# EAGLE design PCstick (EAGLE 4.15)
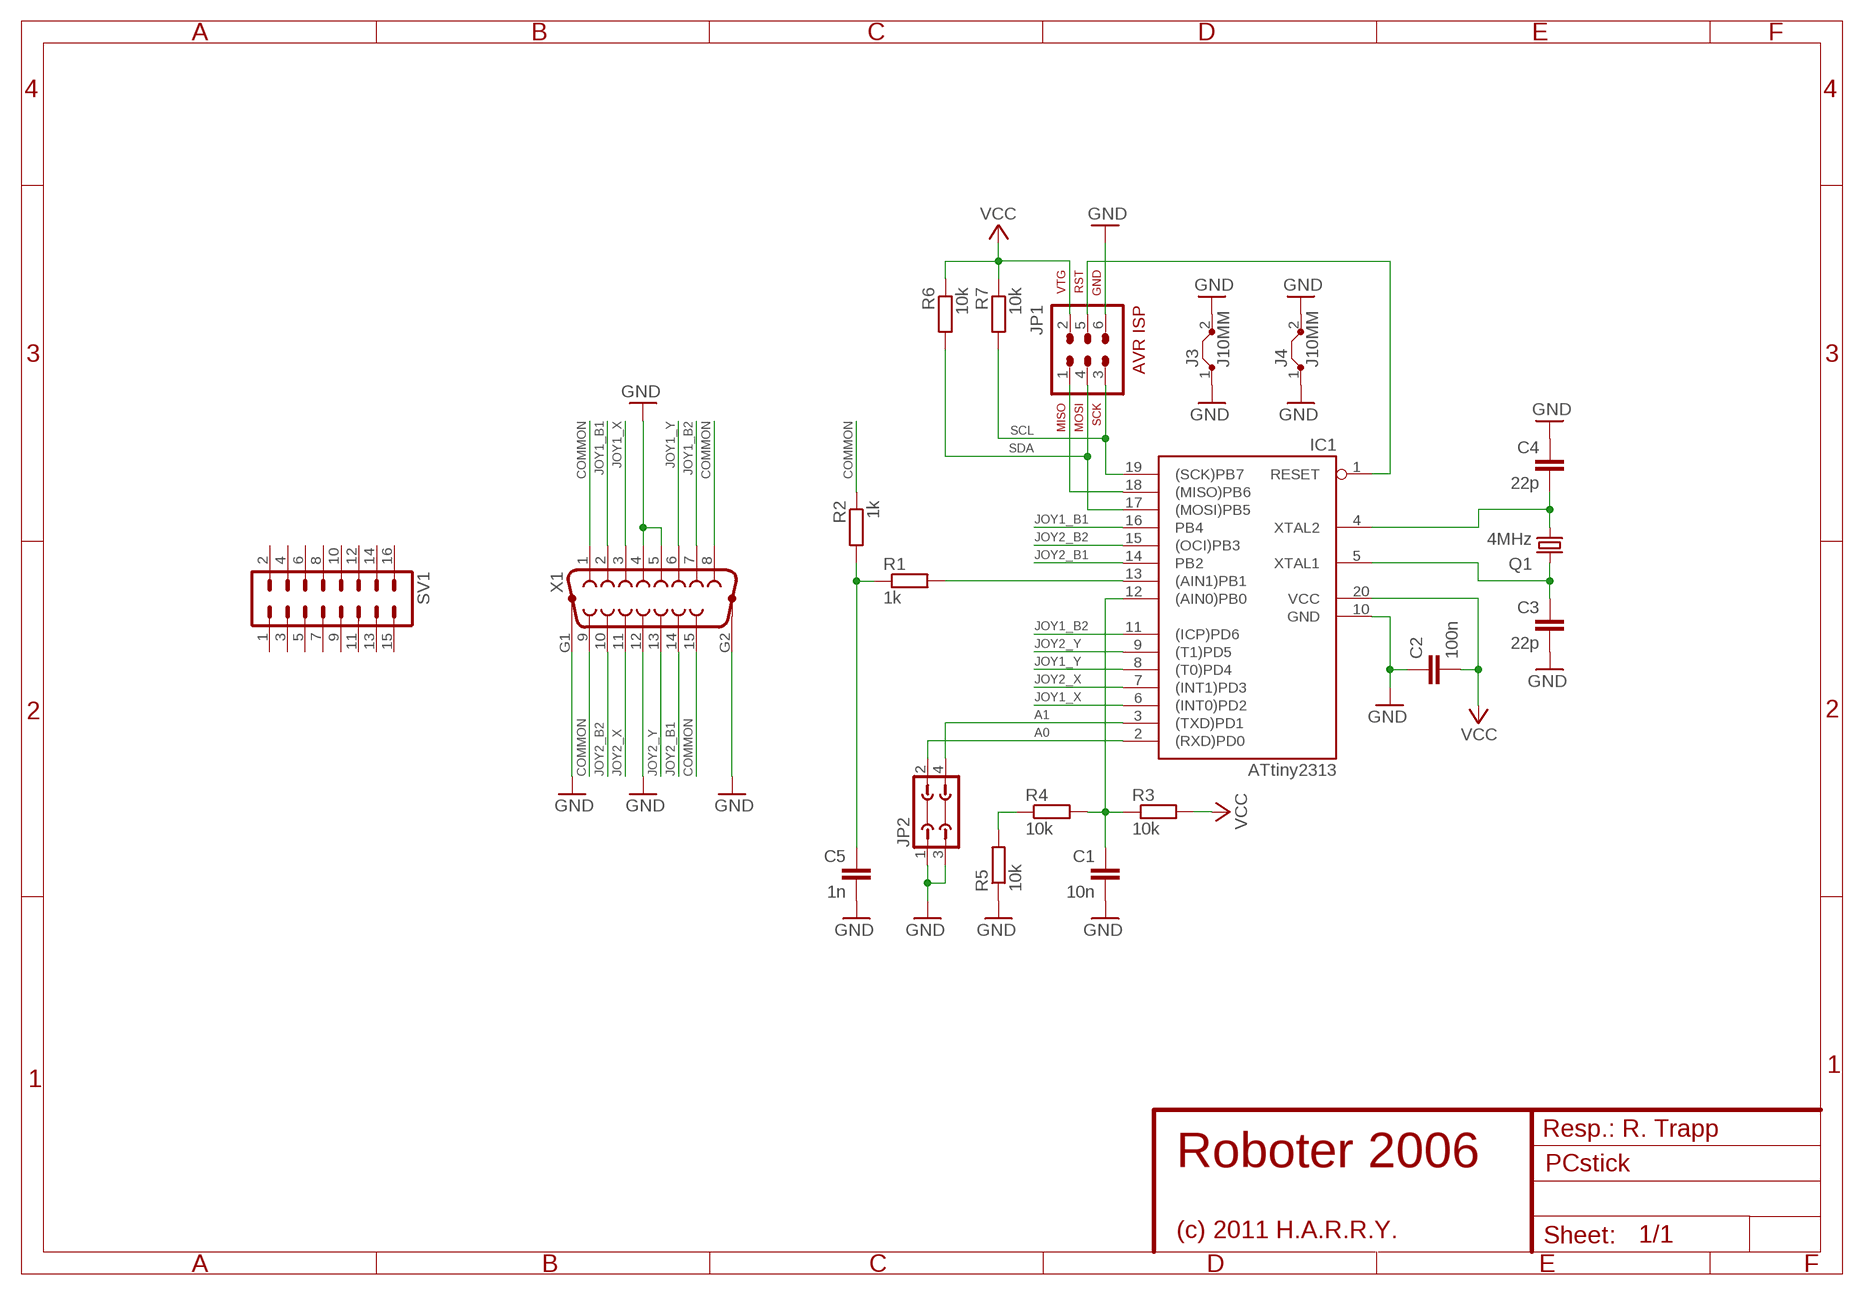
[diagram p0: schematic, sheet 1]

## Parts
C1  10n  C-EU050-025X075  [C050-025X075]
C2  100n  C-EU025-025X050  [C025-025X050]
C3  22p  C-EU025-025X050  [C025-025X050]
C4  22p  C-EU025-025X050  [C025-025X050]
C5  1n  C-EU050-025X075  [C050-025X075]
IC1  ATtiny2313  AT90S2313P  [DIL20]
J1  JUMP-Q  [JUMP]
J2  JUMP-Q  [JUMP]
J3  J10MM  [10]
J4  J10MM  [10]
JP1  AVR-ISP-6  [AVR-ISP-6]
JP2  JP2Q  [JP2Q]
Q1  4MHz  CRYTALHC49U-LM  [HC49U-LM]
R1  1k  R-EU_0204/2V  [0204V]
R2  1k  R-EU_0207/12  [0207/12]
R3  10k  R-EU_0207/15  [0207/15]
R4  10k  R-EU_0204/7  [0204/7]
R5  10k  R-EU_0204/7  [0204/7]
R6  10k  R-EU_0204/2V  [0204V]
R7  10k  R-EU_0204/2V  [0204V]
SV1  ML16  [ML16]
X1  F15VP  [F15VP]

## Nets
A0: IC1.2((RXD)PD0) JP2.2
A1: IC1.3((TXD)PD1) JP2.4
COMMON: R2.1 X1.1 X1.8 X1.9 X1.15
GND: C1.2 C2.1 C3.2 C4.1 C5.2 IC1.10(GND) J3.1 J3.2 J4.1 J4.2 JP1.6 JP2.1 JP2.3 R5.1 X1.4 X1.5 X1.12 X1.G1 X1.G2
JOY1_B1: IC1.16(PB4) X1.2
JOY1_B2: IC1.11((ICP)PD6) X1.7
JOY1_X: IC1.6((INT0)PD2) X1.3
JOY1_Y: IC1.8((T0)PD4) X1.6
JOY2_B1: IC1.14(PB2) X1.14
JOY2_B2: IC1.15((OCI)PB3) X1.10
JOY2_X: IC1.7((INT1)PD3) X1.11
JOY2_Y: IC1.9((T1)PD5) X1.13
N$1: C5.1 R1.1 R2.2
N$2: C3.1 IC1.5(XTAL1) Q1.2
N$3: C4.2 IC1.4(XTAL2) Q1.1
N$4: C1.1 IC1.12((AIN0)PB0) R3.1 R4.2
N$5: IC1.13((AIN1)PB1) R1.2
N$9: IC1.1(RESET) JP1.5
N$17: R4.1 R5.2
PB6: IC1.18((MISO)PB6) JP1.1
SCL: IC1.19((SCK)PB7) JP1.3 R7.2
SDA: IC1.17((MOSI)PB5) JP1.4 R6.2
VCC: C2.2 IC1.20(VCC) JP1.2 R3.2 R6.1 R7.1
Unconnected: SV1.1 SV1.2 SV1.3 SV1.4 SV1.5 SV1.6 SV1.7 SV1.8 SV1.9 SV1.10 SV1.11 SV1.12 SV1.13 SV1.14 SV1.15 SV1.16

## Notes on the sheet
- Resp.: R. Trapp
- Roboter 2006
- (c) 2011 H.A.R.R.Y.

## Library data of the parts
C1-C5 = rcl:C-EU: CAPACITOR, European symbol
IC1 = atmel:AT90S2313: MICROCONTROLLER 2 Kbytes FLASH 128 bytes SRAM 128 bytes EEPROM UART
J1 J2 = jumper:JUMP-Q: JUMPER header
J3 J4 = jumper:J: Bridge
JP1 = atmel-1:AVR-ISP-6: AVR ISP-6 Serial Programming Header
JP2 = jumper:JP2Q: JUMPER
Q1 = crystal:CRYTAL: CRYSTAL
R1-R7 = rcl:R-EU_: RESISTOR, European symbol
SV1 = con-harting-ml:ML16: HARTING
X1 = con-subd:F15VP: SUB-D

## Board
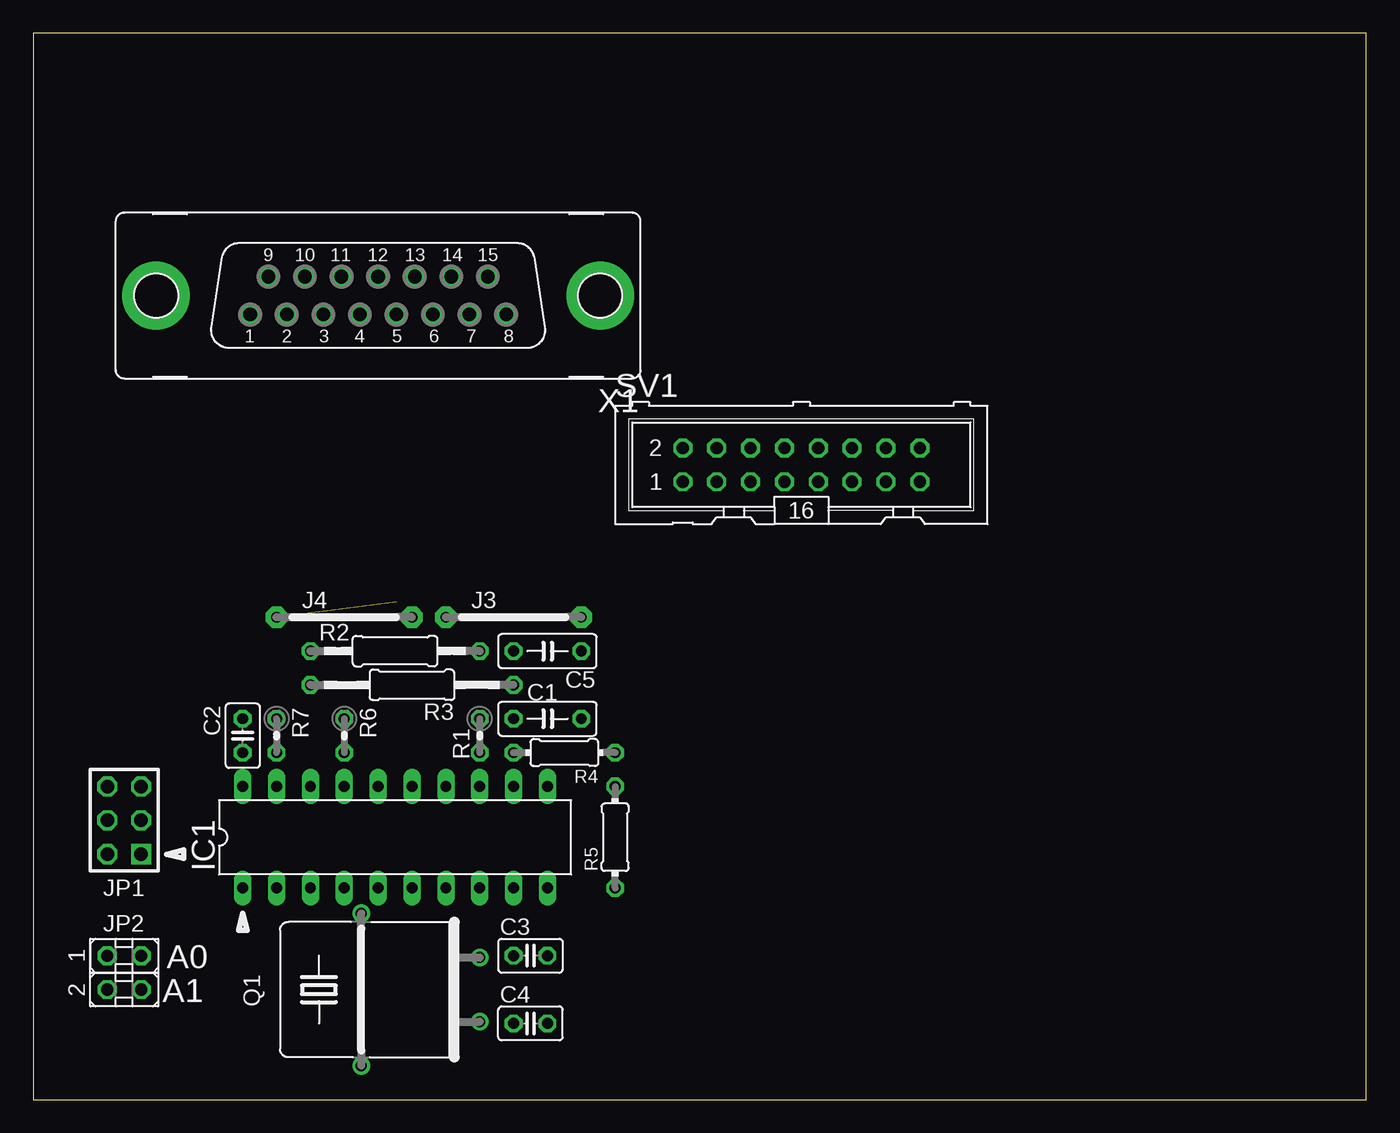
[diagram p1: board, top side]
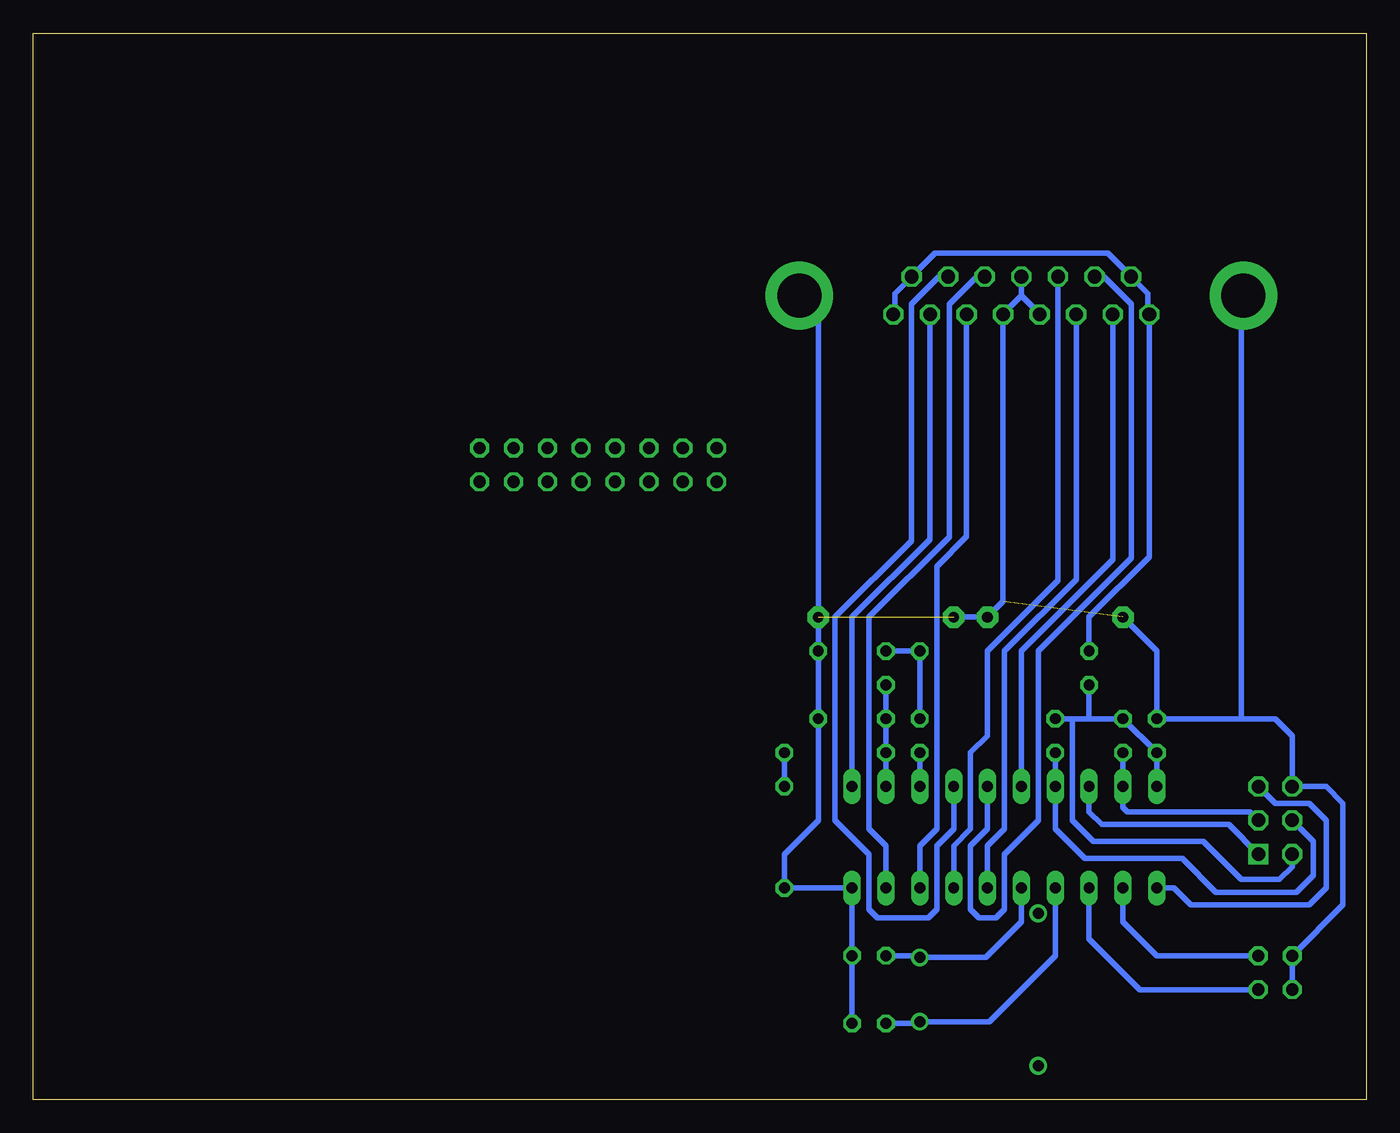
[diagram p2: board, bottom side, seen from below]

Size 100 x 80 mm. Coordinates in mm from the lower left corner, seen from the top.
Outline: 0,0 100,0 100,80 0,80 0,0
Copper layers (1*16): Top 0.035mm / dielectric 1.5mm / Bottom 0.035mm
Design rules "default": minimum track width 10mil, minimum drill 24mil, track to track 8mil, track to pad 8mil, pad to pad 8mil, via to via 8mil, smd to smd 8mil, copper to edge 40mil, drill to drill 8mil, minimum pad ring 10mil, minimum via ring 8mil, stop-mask expansion 4mil, vias tented up to drill 0mil, thermal gap 10mil

### Footprints (pad centres in the part's own frame; a part is rotated, then mirrored left to right if it is on the bottom)
C050-025X075 = drill 0.813 octagon: 1 -2.54,0; 2 2.54,0
C025-025X050 = drill 0.813 octagon: 1 -1.27,0; 2 1.27,0
DIL20 = drill 0.813 long: 1 -11.43,-3.81; 2 -8.89,-3.81; 3 -6.35,-3.81; 4 -3.81,-3.81; 5 -1.27,-3.81; 6 1.27,-3.81; 7 3.81,-3.81; 8 6.35,-3.81; 9 8.89,-3.81; 10 11.43,-3.81; 11 11.43,3.81; 12 8.89,3.81; 13 6.35,3.81; 14 3.81,3.81; 15 1.27,3.81; 16 -1.27,3.81; 17 -3.81,3.81; 18 -6.35,3.81; 19 -8.89,3.81; 20 -11.43,3.81
10 = drill 0.813 pad 1.6 octagon: 1 -5.08,0; 2 5.08,0
AVR-ISP-6 = drill 1.016 square: 1 -2.54,-1.27 | drill 1.016 octagon: 2 -2.54,1.27; 3 0,-1.27; 4 0,1.27; 5 2.54,-1.27; 6 2.54,1.27
JP2Q = drill 0.914 octagon: 1 -1.27,-1.27; 2 -1.27,1.27; 3 1.27,-1.27; 4 1.27,1.27
HC49U-LM = drill 0.813 round: 1 -2.413,-5.08; 2 2.413,-5.08; M -5.715,3.81; M1 5.715,3.81
0204V = drill 0.813 octagon: 1 -1.27,0; 2 1.27,0
0207/12 = drill 0.813 octagon: 1 -6.35,0; 2 6.35,0
0207/15 = drill 0.813 octagon: 1 -7.62,0; 2 7.62,0
0204/7 = drill 0.813 octagon: 1 -3.81,0; 2 3.81,0
ML16 = drill 0.914 octagon: 1 -8.89,-1.27; 2 -8.89,1.27; 3 -6.35,-1.27; 4 -6.35,1.27; 5 -3.81,-1.27; 6 -3.81,1.27; 7 -1.27,-1.27; 8 -1.27,1.27; 9 1.27,-1.27; 10 1.27,1.27; 11 3.81,-1.27; 12 3.81,1.27; 13 6.35,-1.27; 14 6.35,1.27; 15 8.89,-1.27; 16 8.89,1.27
F15VP = drill 1.016 octagon: 1 9.601,1.422; 2 6.858,1.422; 3 4.115,1.422; 4 1.372,1.422; 5 -1.372,1.422; 6 -4.115,1.422; 7 -6.858,1.422; 8 -9.601,1.422; 9 8.23,-1.422; 10 5.486,-1.422; 11 2.743,-1.422; 12 0,-1.422; 13 -2.743,-1.422; 14 -5.486,-1.422; 15 -8.23,-1.422 | drill 3.302 pad 5.08 round: G1 -16.662,0; G2 16.662,0

### Placement (x,y rotation side)
C1  38.57,28.57 0 top
C2  15.71,27.3 270 top
C3  37.3,10.79 0 top
C4  37.3,5.71 180 top
C5  38.57,33.65 0 top
IC1  27.14,19.68 0 top
J1  6.82,10.79 90 top
J2  6.82,8.25 90 top
J3  36.03,36.19 0 top
J4  23.33,36.19 0 top
JP1  6.82,20.95 90 top
JP2  6.82,9.52 270 top
Q1  28.41,8.25 90 top
R1  33.49,27.3 270 top
R2  27.14,33.65 0 top
R3  28.41,31.11 180 top
R4  39.84,26.03 180 top
R5  43.65,19.68 90 top
R6  23.33,27.3 270 top
R7  18.25,27.3 270 top
SV1  57.62,47.62 0 top
X1  25.87,60.32 180 top

### Tracks (layer width: path | path; a pad name or v marks a point on that pad's centre or on a via)
A0
  Bottom 0.406: IC1.2 18.25,13.33 15.71,10.79 JP2.2
A1
  Bottom 0.406: JP2.4 16.98,8.25 20.79,12.06 IC1.3
COMMON
  Bottom 0.406: R2.1 20.79,36.19 16.27,40.71 X1.1 16.27,58.97 16.37,59.08 16.37,60.47 18.12,62.23 | 33.62,62.23 32.35,63.5 19.39,63.5 18.12,62.23 | 33.62,62.23 X1.15 | 18.12,62.23 X1.9 | 33.62,62.23 35.37,60.47 35.37,59.08 35.47,58.97 X1.8
GND  (2 unrouted)
  Bottom 0.406: C4.1 C3.2 IC1.10 R5.1 43.65,18.41 41.11,20.95 C1.2 C5.2 J3.2 41.11,58.9 X1.G1 | 25.87,60.32 X1.12 | 25.87,60.32 27.24,58.95 X1.5 27.24,37.36 J4.2 J3.1 | X1.4 24.5,58.95 25.87,60.32 | 9.36,28.57 6.82,28.57 5.55,27.3 JP1.6 3.01,23.49 1.74,22.22 1.74,14.6 JP2.1 JP2.3 | 9.36,28.57 C2.1 15.71,33.65 J4.1 | X1.G2 9.36,60.17 9.36,28.57
JOY1_B1
  Bottom 0.406: X1.2 19.01,40.51 25.87,33.65 IC1.16
JOY1_B2
  Bottom 0.406: X1.7 32.73,42.03 38.57,36.19 IC1.11
JOY1_X
  Bottom 0.406: X1.3 21.75,39.04 27.14,33.65 27.14,20.31 28.41,19.04 IC1.6
JOY1_Y
  Bottom 0.406: X1.6 29.98,42.23 32.22,40 32.22,20.31 33.49,19.04 IC1.8
JOY2_B1
  Bottom 0.406: X1.14 32.07,61.74 34.12,59.69 34.12,41.91 39.84,36.19 39.84,20.95 37.3,18.41 37.3,14.28 36.66,13.65 32.85,13.65 32.22,14.28 32.22,19.04 30.95,20.31 IC1.14
JOY2_B2
  Bottom 0.406: X1.10 19.67,61.74 17.61,59.69 17.61,40.64 24.6,33.65 24.6,20.95 27.14,18.41 27.14,14.28 27.77,13.65 29.04,13.65 29.68,14.28 29.68,19.04 28.41,20.31 IC1.15
JOY2_X
  Bottom 0.406: IC1.7 30.95,19.04 29.68,20.31 29.68,26.03 28.41,27.3 28.41,33.65 23.13,38.93 X1.11
JOY2_Y
  Bottom 0.406: IC1.9 36.03,19.04 37.3,20.31 37.3,36.19 31.27,42.22 31.27,59.69 29.21,61.74 X1.13
N$1
  Bottom 0.406: R1.1 R2.2 C5.1
N$2
  Bottom 0.406: IC1.5 25.87,13.33 28.54,10.66 Q1.2 33.49,10.79 C3.1
N$3
  Bottom 0.406: IC1.4 23.33,10.79 28.28,5.84 Q1.1 33.49,5.71 C4.2
N$4
  Bottom 0.406: R3.1 C1.1 R4.2 IC1.12
N$5
  Bottom 0.406: IC1.13 R1.2
N$9
  Bottom 0.406: JP1.5 6.82,22.22 4.28,22.22 3.01,20.95 3.01,15.87 4.28,14.6 13.17,14.6 14.44,15.87 IC1.1
N$17
  Bottom 0.406: R5.2 R4.1
PB6
  Bottom 0.406: JP1.1 10.31,20.63 19.84,20.63 20.79,21.58 IC1.18
SCL
  Bottom 0.406: R7.2 IC1.19 18.25,21.9 17.93,21.58 8.73,21.58 JP1.3
SDA
  Bottom 0.406: R6.2 IC1.17 23.33,20.31 21.11,18.09 13.81,18.09 11.27,15.55 5.23,15.55 3.96,16.82 3.96,19.36 JP1.4
VCC
  Bottom 0.406: 22.06,28.57 20.79,28.57 | 20.79,28.57 R7.1 C2.2 IC1.20 | 22.06,28.57 R6.1 | JP1.2 5.55,17.46 6.5,16.5 9.36,16.5 12.22,19.36 20.47,19.36 22.06,20.95 22.06,28.57 | 20.79,28.57 R3.2

### Text on the board
tPlace: A0 | A1